# EAGLE schematic latdr31 (EAGLE 7.7.0)
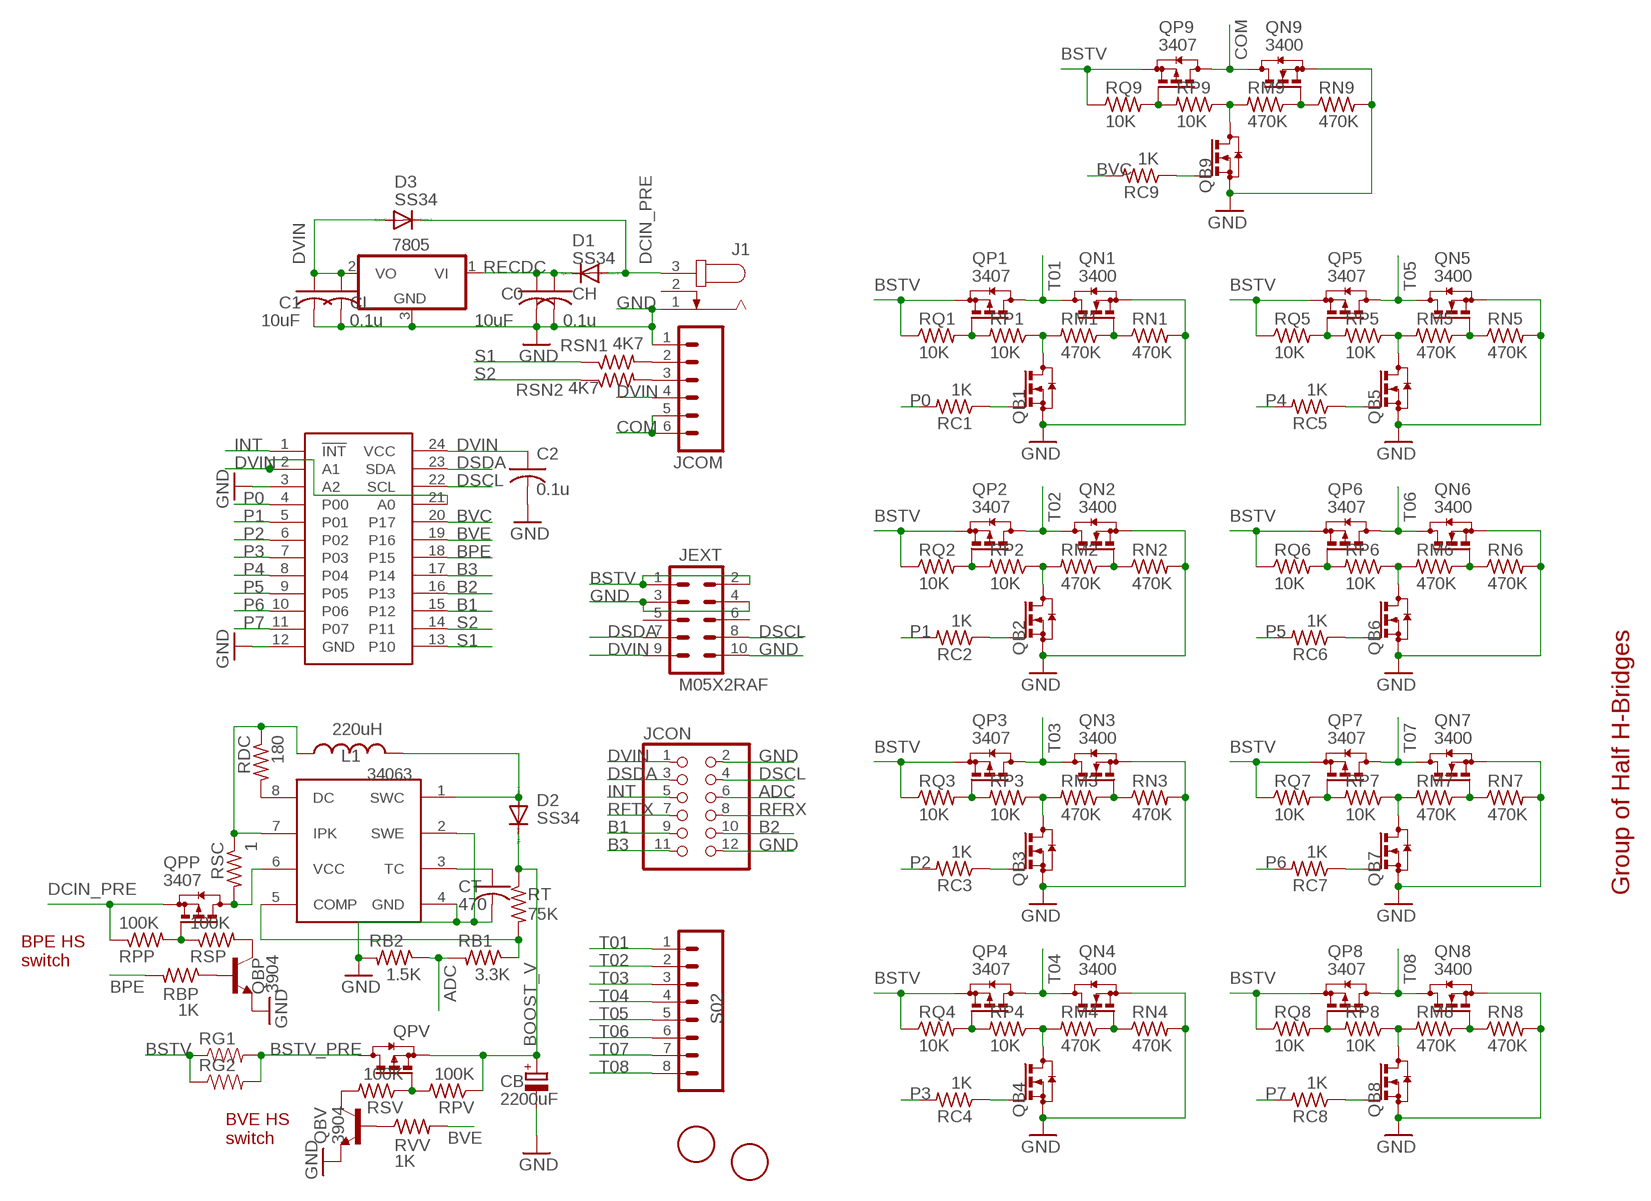
[diagram p0: schematic, sheet 1]

## Parts
0F  FIDUCIAL  [FIDUCIAL_1MM]
1F  FIDUCIAL  [FIDUCIAL_1MM]
7805  7805DT  [TO252]
34063  MC33063/MC34063D  [SO08]
C0  10uF  C-USC0805K  [C0805K]
C1  10uF  C-USC0805K  [C0805K]
C2  0.1u  C-USC0603  [C0603]
CB  2200uF  CPOL-EUE7.5-16  [E7,5-16]
CH  0.1u  C-USC0603  [C0603]
CL  0.1u  C-USC0603  [C0603]
CT  470  C-USC0603K  [C0603K]
D1  SS34  DIODE-SMB  [SMB]
D2  SS34  DIODE-SMB  [SMB]
D3  SS34  DIODE-SMB  [SMB]
J1  JACK-PLUG0  [SPC4077]
JCOM  M065MM  [SCREWTERMINAL-5MM-6]
JCON  PINHD-2X6  [2X06]
JEXT  M05X2RAF  [2X5-RAF]
L1  220uH  INDUCTORCR54  [CR54]
PCA9555  PCF8575TSSOP24  [TSSOP24]
QB1  BSS123  [SOT23]
QB2  BSS123  [SOT23]
QB3  BSS123  [SOT23]
QB4  BSS123  [SOT23]
QB5  BSS123  [SOT23]
QB6  BSS123  [SOT23]
QB7  BSS123  [SOT23]
QB8  BSS123  [SOT23]
QB9  BSS123  [SOT23]
QBP  3904  TRANSISTOR_NPNSOT23-3  [SOT23-3]
QBV  3904  TRANSISTOR_NPNSOT23-3  [SOT23-3]
QN1  3400  BSS123  [SOT23]
QN2  3400  BSS123  [SOT23]
QN3  3400  BSS123  [SOT23]
QN4  3400  BSS123  [SOT23]
QN5  3400  BSS123  [SOT23]
QN6  3400  BSS123  [SOT23]
QN7  3400  BSS123  [SOT23]
QN8  3400  BSS123  [SOT23]
QN9  3400  BSS123  [SOT23]
QP1  3407  BSS84  [SOT23]
QP2  3407  BSS84  [SOT23]
QP3  3407  BSS84  [SOT23]
QP4  3407  BSS84  [SOT23]
QP5  3407  BSS84  [SOT23]
QP6  3407  BSS84  [SOT23]
QP7  3407  BSS84  [SOT23]
QP8  3407  BSS84  [SOT23]
QP9  3407  BSS84  [SOT23]
QPP  3407  BSS84  [SOT23]
QPV  BSS84  [SOT23]
RB1  3.3K  R-US_R0603  [R0603]
RB2  1.5K  R-US_R0603  [R0603]
RBP  1K  R-US_R0603  [R0603]
RC1  1K  R-US_R0603  [R0603]
RC2  1K  R-US_R0603  [R0603]
RC3  1K  R-US_R0603  [R0603]
RC4  1K  R-US_R0603  [R0603]
RC5  1K  R-US_R0603  [R0603]
RC6  1K  R-US_R0603  [R0603]
RC7  1K  R-US_R0603  [R0603]
RC8  1K  R-US_R0603  [R0603]
RC9  1K  R-US_R0603  [R0603]
RDC  180  R-US_R0603  [R0603]
RG1  RESISTOR2512  [R2512]
RG2  RESISTOR2512  [R2512]
RM1  470K  R-US_R0603  [R0603]
RM2  470K  R-US_R0603  [R0603]
RM3  470K  R-US_R0603  [R0603]
RM4  470K  R-US_R0603  [R0603]
RM5  470K  R-US_R0603  [R0603]
RM6  470K  R-US_R0603  [R0603]
RM7  470K  R-US_R0603  [R0603]
RM8  470K  R-US_R0603  [R0603]
RM9  470K  R-US_R0603  [R0603]
RN1  470K  R-US_R0603  [R0603]
RN2  470K  R-US_R0603  [R0603]
RN3  470K  R-US_R0603  [R0603]
RN4  470K  R-US_R0603  [R0603]
RN5  470K  R-US_R0603  [R0603]
RN6  470K  R-US_R0603  [R0603]
RN7  470K  R-US_R0603  [R0603]
RN8  470K  R-US_R0603  [R0603]
RN9  470K  R-US_R0603  [R0603]
RP1  10K  R-US_R0603  [R0603]
RP2  10K  R-US_R0603  [R0603]
RP3  10K  R-US_R0603  [R0603]
RP4  10K  R-US_R0603  [R0603]
RP5  10K  R-US_R0603  [R0603]
RP6  10K  R-US_R0603  [R0603]
RP7  10K  R-US_R0603  [R0603]
RP8  10K  R-US_R0603  [R0603]
RP9  10K  R-US_R0603  [R0603]
RPP  100K  R-US_R0603  [R0603]
RPV  100K  R-US_R0603  [R0603]
RQ1  10K  R-US_R0603  [R0603]
RQ2  10K  R-US_R0603  [R0603]
RQ3  10K  R-US_R0603  [R0603]
RQ4  10K  R-US_R0603  [R0603]
RQ5  10K  R-US_R0603  [R0603]
RQ6  10K  R-US_R0603  [R0603]
RQ7  10K  R-US_R0603  [R0603]
RQ8  10K  R-US_R0603  [R0603]
RQ9  10K  R-US_R0603  [R0603]
RSC  1  R-US_R0603  [R0603]
RSN1  4K7  R-US_R0603  [R0603]
RSN2  4K7  R-US_R0603  [R0603]
RSP  100K  R-US_R0603  [R0603]
RSV  100K  R-US_R0603  [R0603]
RT  75K  R-US_R0603  [R0603]
RVV  1K  R-US_R0603  [R0603]
S02  M085MM-8  [SCREWTERMINAL-5MM-8]

## Nets
ADC [signal]: JCON.6 RB1.2 RB2.1
B1: JCON.9 PCA9555.15(P12)
B2: JCON.10 PCA9555.16(P13)
B3: JCON.11 PCA9555.17(P14)
BOOST_V: CB.+ D2.C QPV.2(S) RPV.1 RT.1
BPE: PCA9555.18(P15) RBP.2
BSTV [power]: JEXT.1 JEXT.2 QP1.2(S) QP2.2(S) QP3.2(S) QP4.2(S) QP5.2(S) QP6.2(S) QP7.2(S) QP8.2(S) QP9.2(S) RG1.1 RG2.1 RQ1.1 RQ2.1 RQ3.1 RQ4.1 RQ5.1 RQ6.1 RQ7.1 RQ8.1 RQ9.1
BSTV_PRE [power]: QPV.3(D) RG1.2 RG2.2
BVC: PCA9555.20(P17) RC9.2
BVE: PCA9555.19(P16) RVV.2
COM [power]: JCOM.5 JCOM.6 QN9.3(D) QP9.3(D)
DCIN_PRE: D1.A D3.C J1.3 QPP.2(S) RPP.1
DSCL [signal]: JCON.4 JEXT.8 PCA9555.22(SCL)
DSDA [signal]: JCON.3 JEXT.7 PCA9555.23(SDA)
DVIN [power]: 7805.2(VO) C1.1 C2.1 CL.1 D3.A JCOM.4 JCON.1 JEXT.9 PCA9555.2(A1) PCA9555.21(A0) PCA9555.24(VCC)
GND: 7805.3(GND) 34063.2(SWE) 34063.4(GND) C0.2 C1.2 C2.2 CB.- CH.2 CL.2 CT.2 J1.1 JCOM.1 JCON.2 JCON.12 JEXT.3 JEXT.4 JEXT.10 PCA9555.3(A2) PCA9555.12(GND) QB1.2(S) QB2.2(S) QB3.2(S) QB4.2(S) QB5.2(S) QB6.2(S) QB7.2(S) QB8.2(S) QB9.2(S) QBP.2(E) QBV.2(E) QN1.2(S) QN2.2(S) QN3.2(S) QN4.2(S) QN5.2(S) QN6.2(S) QN7.2(S) QN8.2(S) QN9.2(S) RB2.2 RN1.2 RN2.2 RN3.2 RN4.2 RN5.2 RN6.2 RN7.2 RN8.2 RN9.2
INT: JCON.5 PCA9555.1(!INT)
N$1: 34063.1(SWC) D2.A L1.P$2
N$2: JCOM.2 RSN1.2
N$3: JCOM.3 RSN2.2
N$6: QB2.1(G) RC2.1
N$7: QB9.1(G) RC9.1
N$11: QB1.1(G) RC1.1
N$12: QB4.1(G) RC4.1
N$13: QB3.1(G) RC3.1
N$17: 34063.3(TC) CT.1
N$19: QB5.1(G) RC5.1
N$23: QB6.1(G) RC6.1
N$24: 34063.8(DC) RDC.2
N$26: 34063.7(IPK) L1.P$1 RDC.1 RSC.1
N$27: 34063.6(VCC) QPP.3(D) RSC.2
N$28: QBP.1(B) RBP.1
N$29: 34063.5(COMP) RB1.1 RT.2
N$30: QPP.1(G) RPP.2 RSP.1
N$33: QB7.1(G) RC7.1
N$34: QBV.3(C) RSV.2
N$35: QBP.3(C) RSP.2
N$38: QPV.1(G) RPV.2 RSV.1
N$40: QB8.1(G) RC8.1
N$50: QBV.1(B) RVV.1
N$100: QB9.3(D) RM9.2 RP9.1
N$101: QB1.3(D) RM1.2 RP1.1
N$102: QB2.3(D) RM2.2 RP2.1
N$103: QB3.3(D) RM3.2 RP3.1
N$104: QB4.3(D) RM4.2 RP4.1
N$105: QB5.3(D) RM5.2 RP5.1
N$106: QB6.3(D) RM6.2 RP6.1
N$107: QB7.3(D) RM7.2 RP7.1
N$108: QB8.3(D) RM8.2 RP8.1
N$200: QP9.1(G) RP9.2 RQ9.2
N$201: QP1.1(G) RP1.2 RQ1.2
N$202: QP2.1(G) RP2.2 RQ2.2
N$203: QP3.1(G) RP3.2 RQ3.2
N$204: QP4.1(G) RP4.2 RQ4.2
N$205: QP5.1(G) RP5.2 RQ5.2
N$206: QP6.1(G) RP6.2 RQ6.2
N$207: QP7.1(G) RP7.2 RQ7.2
N$208: QP8.1(G) RP8.2 RQ8.2
N$300: QN9.1(G) RM9.1 RN9.1
N$301: QN1.1(G) RM1.1 RN1.1
N$302: QN2.1(G) RM2.1 RN2.1
N$303: QN3.1(G) RM3.1 RN3.1
N$304: QN4.1(G) RM4.1 RN4.1
N$305: QN5.1(G) RM5.1 RN5.1
N$306: QN6.1(G) RM6.1 RN6.1
N$307: QN7.1(G) RM7.1 RN7.1
N$308: QN8.1(G) RM8.1 RN8.1
P0: PCA9555.4(P00) RC1.2
P1: PCA9555.5(P01) RC2.2
P2: PCA9555.6(P02) RC3.2
P3: PCA9555.7(P03) RC4.2
P4: PCA9555.8(P04) RC5.2
P5: PCA9555.9(P05) RC6.2
P6: PCA9555.10(P06) RC7.2
P7: PCA9555.11(P07) RC8.2
RECDC: 7805.1(VI) C0.1 CH.1 D1.C
RFRX: JCON.8
RFTX: JCON.7
S1: PCA9555.13(P10) RSN1.1
S2: PCA9555.14(P11) RSN2.1
T01 [power]: QN1.3(D) QP1.3(D) S02.1
T02 [power]: QN2.3(D) QP2.3(D) S02.2
T03 [power]: QN3.3(D) QP3.3(D) S02.3
T04 [power]: QN4.3(D) QP4.3(D) S02.4
T05 [power]: QN5.3(D) QP5.3(D) S02.5
T06 [power]: QN6.3(D) QP6.3(D) S02.6
T07 [power]: QN7.3(D) QP7.3(D) S02.7
T08 [power]: QN8.3(D) QP8.3(D) S02.8
Unconnected: J1.2 JEXT.5 JEXT.6

## Notes on the sheet
- Group of Half H-Bridges
- BPE HS
  switch
- BVE HS
  switch

## Library data of the parts
0F 1F = adafruitGood:FIDUCIAL: For use by pick and place machines to calibrate the vision/machine, 1mm By microbuilder.eu
7805 = linear:78*: Positive VOLTAGE REGULATOR Source: http://cache.national.com/ds/LM/LM78L05.pdf http://www.fairchildsemi.com/ds/LM/LM7805.pdf
34063 = adafruit:MC33063/MC34063: MC33063 and MC34063 Basic DC/DC converter with internal power-NPN transistor, 100KHz, 1.5A peak switch current. 3-40 input/output.
C0 C1 C2 CH CL CT = adafruit:C-US: CAPACITOR, American symbol
CB = rcl:CPOL-EU: POLARIZED CAPACITOR, European symbol
D1-D3 = diode:DIODE-: DIODE
J1 = con-jack:JACK-PLUG: DC POWER JACK Power Jack, DC, Right Angle, Through Hole, Rated 5A at 16VDC, PC Terminals Distributor: Farnell (www.Farnell.de) Drawing: 84N1161.pdf / 84N1162.pdf Manufacturer: SPC Technology (www.spctechnology.com) Type: SPC4077 / SPC 4078; OC_FARNELL: unknown; OC_NEWARK: unknown
JCOM = SparkFun:M06: Header 6 Standard 6-pin 0.1" header. Use with straight break away headers (SKU : PRT-00116), right angle break away headers (PRT-00553), swiss pins (PRT-00743), machine pins (PRT-00117), and female headers (PRT-00115). Molex polarized connector foot print use with SKU : PRT-08094 with associated crimp pins and housings. NOTES ON THE VARIANTS LOCK and LOCK_LONGPADS... This footprint was designed to help hold the alignment of a through-hole component (i.e. 6-pin header) while soldering it into place. You may notice that each hole has been shifted either up or down by 0.005 of an inch from it's more standard position (which is a perfectly straight line). This slight alteration caused the pins (the squares in the middle) to touch the edges of the holes. Because they are alternating, it causes a "brace" to hold the component in place. 0.005 has proven to be the perfect amount of "off-center" position when using our standard breakaway headers. Although looks a little odd when you look at the bare footprint, once you have a header in there, the alteration is very hard to notice. Also, if you push a header all the way into place, it is covered up entirely on the bottom side. This idea of altering the position of holes to aid alignment will be further integrated into the Sparkfun Library for other footprints. It can help hold any component with 3 or more connection pins.
JCON = pinhead:PINHD-2X6: PIN HEADER
JEXT = SparkFunNew:M05X2: Header 5x2 Standard 10-pin dual row 0.1" header. Commonly used with AVR-ISP. Use with Spark Fun Electronics SKU: PRT-00778
L1 = SparkFunNew:INDUCTOR: Inductors Basic Inductor/Choke - 0603 and 1206. Footprints are not proven and vary greatly between part numbers.
PCA9555 = SparkFunNew:PCF8575
QB1-QB9 QN1-QN9 = transistor-small-signal:BSS123: N-CHANNEL MOS FET
QBP QBV = SparkFunNew:TRANSISTOR_NPN: Transistor NPN BJT configuration in SOT23 package. MMBT2222 is the common NPN we use. Double check BCE configuration again layout.
QP1-QP9 QPP QPV = transistor-small-signal:BSS84: P-CHANNEL MOS FET
RB1 RB2 RBP RC1-RC9 RDC RM1-RM9 RN1-RN9 RP1-RP9 RPP RPV RQ1-RQ9 RSC RSP RSV RT RVV = adafruitGood:R-US_: RESISTOR, American symbol
RG1 RG2 = SparkFun:RESISTOR: Resistor Basic schematic elements and footprints for 0603, 1206, and PTH 1/10th watt (small) resistors.
RSN1 RSN2 = adafruit2013:R-US_: RESISTOR, American symbol
S02 = SparkFun:M08: Header 8 Standard 8-pin 0.1" header. Use with straight break away headers (SKU : PRT-00116), right angle break away headers (PRT-00553), swiss pins (PRT-00743), machine pins (PRT-00117), and female headers (PRT-00115).

## Net classes
0 default: width 0.203 mm, clearance 0.178 mm
1 power: width 0.203 mm, clearance 0.178 mm
2 relaypower: width 0.508 mm, clearance 0.305 mm
3 signal: width 0.254 mm, clearance 0.178 mm
4 adc: width 0.406 mm, clearance 0.178 mm